# EAGLE design 12V - 3V3 Buck (1.5A) discrete (EAGLE 6.5.0)
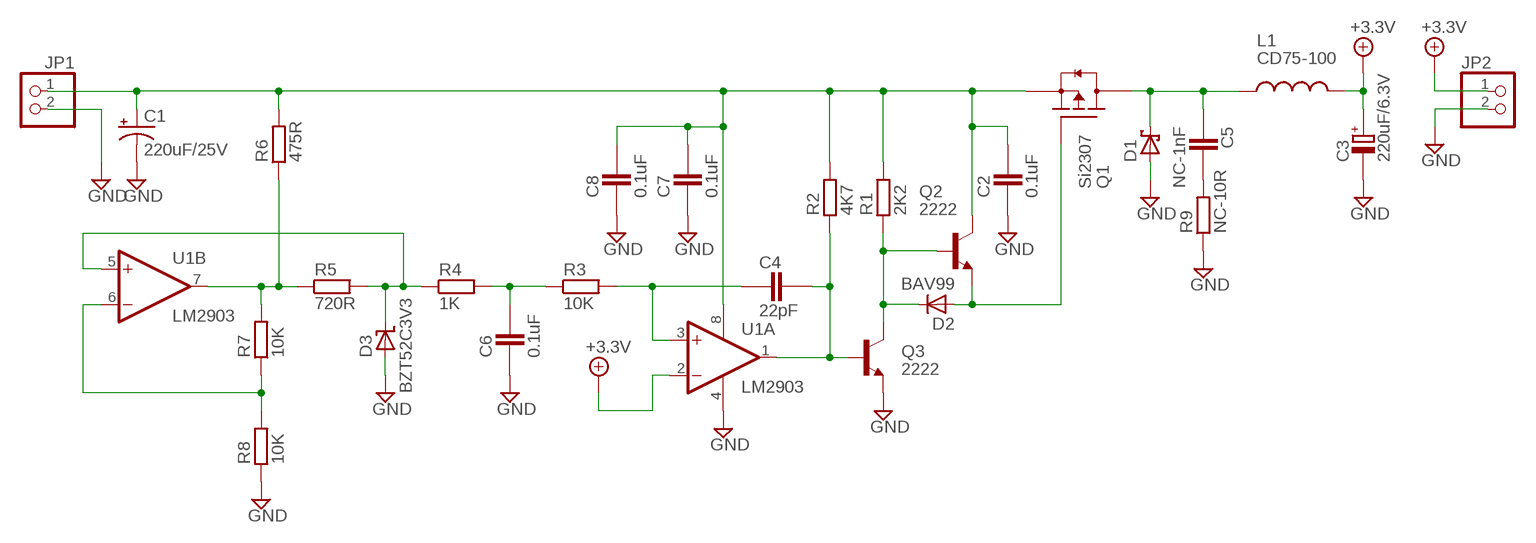
[diagram p0: schematic, sheet 1]

## Parts
C1  220uF/25V  CAP_POLG  [PANASONIC_G]
C2  0.1uF  CAPACITOR_0805  [CAPC2012X145AN]
C3  220uF/6.3V  POLARISED_D_CASE  [CAPMP7343X310N]
C4  22pF  CAPACITOR_0603  [CAPC1608X92N]
C5  NC-1nF  CAPACITOR_0603  [CAPC1608X92N]
C6  0.1uF  CAPACITOR_0603  [CAPC1608X92N]
C7  0.1uF  CAPACITOR_0603  [CAPC1608X92N]
C8  0.1uF  CAPACITOR_0603  [CAPC1608X92N]
D1  SCHOTTKY_SMC  [DIOM7959X265N]
D2  BAV99  DIODE_SOT-23  [SOT95P280X135-3N]
D3  BZT52C3V3  ZENER_SOD-323  [SOD2514X100N]
JP1  PINHD-1X2_2.54  [1X02]
JP2  PINHD-1X2_2.54  [1X02]
L1  CD75-100  CD75  [CD75]
Q1  Si2307  MOSFET-PCH_SOT-23  [SOT95P280X135-3N]
Q2  2222  NPN_SOT-23  [SOT95P280X135-3N]
Q3  2222  NPN_SOT-23  [SOT95P280X135-3N]
R1  2K2  RESISTOR_0603  [RESC1608X55N]
R2  4K7  RESISTOR_0603  [RESC1608X55N]
R3  10K  RESISTOR_1206  [RESC3115X70N]
R4  1K  RESISTOR_0603  [RESC1608X55N]
R5  720R  RESISTOR_0603  [RESC1608X55N]
R6  475R  RESISTOR_0603  [RESC1608X55N]
R7  10K  RESISTOR_0603  [RESC1608X55N]
R8  10K  RESISTOR_0603  [RESC1608X55N]
R9  NC-10R  RESISTOR_0603  [RESC1608X55N]
U1  LM2903  LM393D  [SO08]

## Nets
+3.3V: C3.+ JP2.1 L1.2 U1.2(A:-IN)
GND: C1.- C2.1 C3.- C6.1 C7.1 C8.1 D1.A D3.A JP1.2 JP2.2 Q3.2(E) R8.1 R9.1 U1.4(P:V-)
N$1: D2.3(K) Q2.1(B) Q3.3(C) R1.1
N$2: D2.1(A) Q1.1(G) Q2.2(E)
N$3: C4.2 Q3.1(B) R2.1 U1.1(A:OUT)
N$4: C4.1 R3.2 U1.3(A:+IN)
N$5: C6.2 R3.1 R4.2
N$6: C5.2 R9.2
N$7: C1.+ C2.2 C7.2 C8.2 JP1.1 Q1.2(S) Q2.3(C) R1.2 R2.2 R6.2 U1.8(P:V+)
N$9: R5.1 R6.1 R7.2 U1.7(B:OUT)
N$11: R7.1 R8.2 U1.6(B:-IN)
N$12: D3.K R4.1 R5.2 U1.5(B:+IN)
VO-L: C5.1 D1.K L1.1 Q1.3(D)

## Library data of the parts
C1 = Misc Passives:CAP_POL: Capacitor Polarized These are standard SMD and PTH capacitors. Normally 10uF, 47uF, and 100uF in electrolytic and tantalum varieties. Always verify the external diameter of the through hole cap, it varies with capacity, voltage, and manufacturer. The EIA devices should be standard.
C2 C4-C8 = ipc-7351-capacitor:CAPACITOR_
C3 = ipc-7351-capacitor:POLARISED_
D1 = ipc-7351-diode:SCHOTTKY_
D2 = ipc-7351-diode:DIODE_
D3 = ipc-7351-diode:ZENER_
JP1 JP2 = Misc Conn:PINHD-1X2: PIN HEADER
L1 = Misc Inductors:CD
Q1 = ipc-7351-transistor:MOSFET-PCH_
Q2 Q3 = ipc-7351-transistor:NPN_
R1-R9 = ipc-7351-resistor:RESISTOR_
U1 = linear:LM393: COMPARATOR

## Board
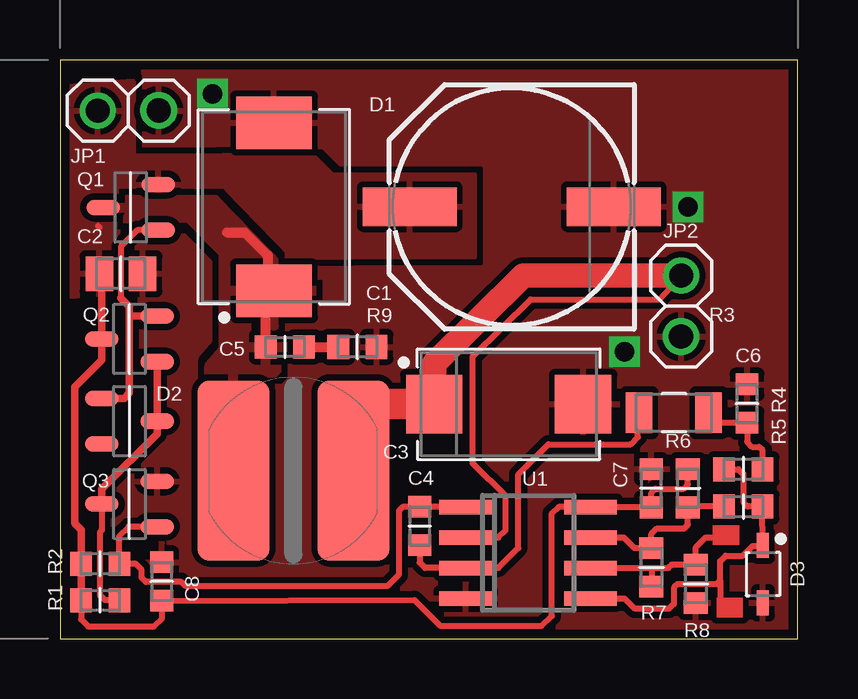
[diagram p1: board, top side]

Size 30.73 x 24.13 mm. Coordinates in mm from the lower left corner, seen from the top.
Outline: 0,0 30.73,0 30.73,24.13 0,24.13 0,0
Copper layers (1*16): Top 0.0356mm / dielectric 1.5011mm / Bottom 0.0356mm
Design rules "oshpark-2layer": minimum track width 6mil, minimum drill 13mil, track to track 6mil, track to pad 6mil, pad to pad 6mil, via to via 6mil, smd to smd 6mil, copper to edge 15mil, drill to drill 6mil, minimum pad ring 7mil, minimum via ring 7mil, stop-mask expansion 4mil, vias tented up to drill 0mil, thermal gap 10mil

### Footprints (pad centres in the part's own frame; a part is rotated, then mirrored left to right if it is on the bottom)
PANASONIC_G = smd 3.9 x 1.6: + 4.25,0; - -4.25,0
CAPC2012X145AN = smd 1.15 x 1.45: 1 -0.9,0; 2 0.9,0
CAPMP7343X310N = smd 2.35 x 2.45: + -3.1,0; - 3.1,0
CAPC1608X92N = smd 0.9 x 0.95: 1 -0.8,0; 2 0.8,0
DIOM7959X265N = smd 2.2 x 3.15: A 3.5,0; K -3.5,0
SOT95P280X135-3N = smd 1.4 x 0.65: 1 -1.15,0.95; 2 -1.15,-0.95; 3 1.15,0
SOD2514X100N = smd 1.05 x 0.5: A 1.2,0; K -1.2,0
1X02 = drill 1: 1 -1.27,0 | drill 1.016: 2 1.27,0
CD75 = smd 7.5 x 3: 1 0,2.5; 2 0,-2.5
RESC1608X55N = smd 0.9 x 1: 1 -0.8,0; 2 0.8,0
RESC3115X70N = smd 1.1 x 1.7: 1 -1.45,0; 2 1.45,0
SO08 = smd 0.6 x 2.2: 1 -1.905,-2.6; 2 -0.635,-2.6; 3 0.635,-2.6; 4 1.905,-2.6; 5 1.905,2.6; 6 0.635,2.6; 7 -0.635,2.6; 8 -1.905,2.6

### Placement (x,y rotation side)
C1  18.82,18.01 180 top
C2  2.54,15.21 180 top
C3  18.69,9.78 0 top
C4  14.99,4.7 90 top
C5  9.37,12.17 0 top
C6  28.63,9.8 270 top
C7  24.64,6.27 270 top
C8  4.24,2.39 270 top
D1  8.92,18.01 90 top
D2  2.9,9.07 0 top
D3  29.29,2.69 270 top
JP1  2.84,22.02 0 top
JP2  25.88,13.87 270 top
L1  9.73,7.01 90 top
Q1  2.95,17.98 180 top
Q2  2.9,12.5 180 top
Q3  2.9,5.61 180 top
R1  1.68,1.6 180 top
R2  1.68,3.12 180 top
R3  25.58,9.42 180 top
R4  28.47,7.06 0 top
R5  28.47,5.51 0 top
R6  26.16,6.27 90 top
R7  24.64,2.97 90 top
R8  26.49,2.29 90 top
R9  12.4,12.17 180 top
U1  19.51,3.58 270 top

### Tracks (layer width: path | path; a pad name or v marks a point on that pad's centre or on a via)
+3.3V
  Top 0.254: U1.2 18.26,4.22 18.57,4.52 18.57,5.94 | 18.57,5.97 18.57,5.94 | 18.57,5.94 17.2,7.32 17.2,11.76 19.61,14.15 24.97,14.15 JP2.1
  Top 1.016: C3.+ 15.6,11.48 19.3,15.14 JP2.1
  Top 1.27: C3.+ 13.11,9.78 12.22,8.89 12.22,7.02 L1.2
GND  (via drill 0.81 pad 1.27)
  other vias: 6.35,22.71 26.16,18.01 23.52,11.96
  pour Top (isolate 0.254, rank 3): -0.03,24.13 30.76,24.16 30.73,-0.08 -0.05,0
N$1
  Top 0.254: R1.1 1.88,1.6 1.68,1.8 1.68,4.45 1.75,4.53 Q3.3
  Top 0.305: Q2.1 D2.3 4.05,8.54 1.75,6.24 Q3.3
N$2
  Top 0.254: 2.54,14.2 2.54,16.36 3.22,17.03 Q1.1
  Top 0.305: D2.1 2.68,10.02 2.9,10.24 2.9,13.36 | 2.9,13.36 2.9,13.84 2.54,14.2 | Q2.2 2.98,13.45 2.9,13.36
N$3
  Top 0.254: U1.1 14.95,5.49 | 14.95,5.49 C4.2 | 14.95,5.49 14.28,5.49 14.12,5.33 14.12,2.67 13.64,2.18 5.23,2.18 5.05,2.36 3.58,2.36 3.4,2.54 3.4,2.87 3.15,3.12 R2.1 2.48,4.28 2.86,4.66 Q3.1
  Top 0.305: 4.06,4.64 Q3.1 | 2.52,3.12 R2.1
N$4
  Top 0.254: C4.1 14.99,3.17 15.21,2.95 U1.3 18.26,2.95 19.1,3.79 19.1,6.86 20.34,8.1 23.77,8.1 24.08,8.41 24.08,9.17 24.11,9.32 R3.2
N$5
  Top 0.254: R4.2 29.27,7.86 29.13,8 28.83,8 28.63,8.2 C6.2 27.45,9 R3.1
N$6
  Top 0.406: C5.2 R9.2
N$7
  Top 0.254: R1.2 0.88,0.8 1.17,0.51 3.91,0.51 4.24,0.84 C8.2 14.77,1.61 15.85,0.53 20.07,0.53 20.5,0.94 20.5,5.23 20.78,5.49 U1.8 24.62,5.49 C7.2 24.64,6.07 24.82,6.25 25.98,6.25 26.16,6.43 R6.2 | 1.64,17.16 1.57,17.22
  Top 0.305: C2.2 1.74,15.1 1.75,13.4 Q2.3 1.75,11.63 0.61,10.49 0.61,4.8 0.88,4.53 R2.2 R1.2
  pour Top (isolate 0.254, rank 2): 17.25,15.93 6.76,15.9 5.05,17.53 3.2,17.48 3.1,17.37 3.1,14.48 -0.41,14.2 -0.41,22.96 3.02,23.24 3.02,20.12 10.49,20.17 11.33,19.33 17.25,19.33
N$9
  Top 0.254: U1.7 23.5,4.22 23.94,3.77 R7.2 24.64,4.37 24.87,4.6 26.01,4.6 26.16,4.75 R6.1 26.2,5.51 R5.1
N$11
  Top 0.254: U1.6 24.64,2.95 | 24.64,2.95 25.35,2.95 25.49,3.09 R8.2 26.49,3.81 26.9,4.22 27.79,4.22 | R7.1 24.66,2.2 24.66,2.92 24.64,2.95
N$12
  Top 0.254: U1.5 23.52,1.68 23.95,1.25 25.38,1.25 25.58,1.45 25.58,2.13 25.73,2.29 27.36,2.29 27.51,2.44 | R4.1 28.27,7.06 28.47,6.86 28.47,5.69 28.65,5.51 R5.2 29.26,5.5 D3.K 29.25,3.86 28.85,3.86 28.45,3.45 27.74,3.45 27.51,3.23 27.51,2.44 | 27.51,2.44 27.51,1.47
VO-L
  Top 0.406: C5.1 8.57,14.06 8.66,14.15 | 6.96,16.94 7.7,16.94 8.66,15.98 8.66,14.22
  Top 1.27: 7.21,7.03 L1.1 | D1.K 8.72,14.51
  pour Top (isolate 0.254): 6.2,9.73 6.22,11.38 6.83,12.06 6.83,16.05 5.36,17.53 2.21,17.5 2.21,18.31 6.45,18.31 9.22,15.44 10.46,15.44 10.46,13.64 9.5,12.6 9.47,11.63 8.31,10.46 8.31,9.73
(copper drawn outside any net)
  shapes: Top area x2